# EAGLE design cc1101 (EAGLE 5.11)
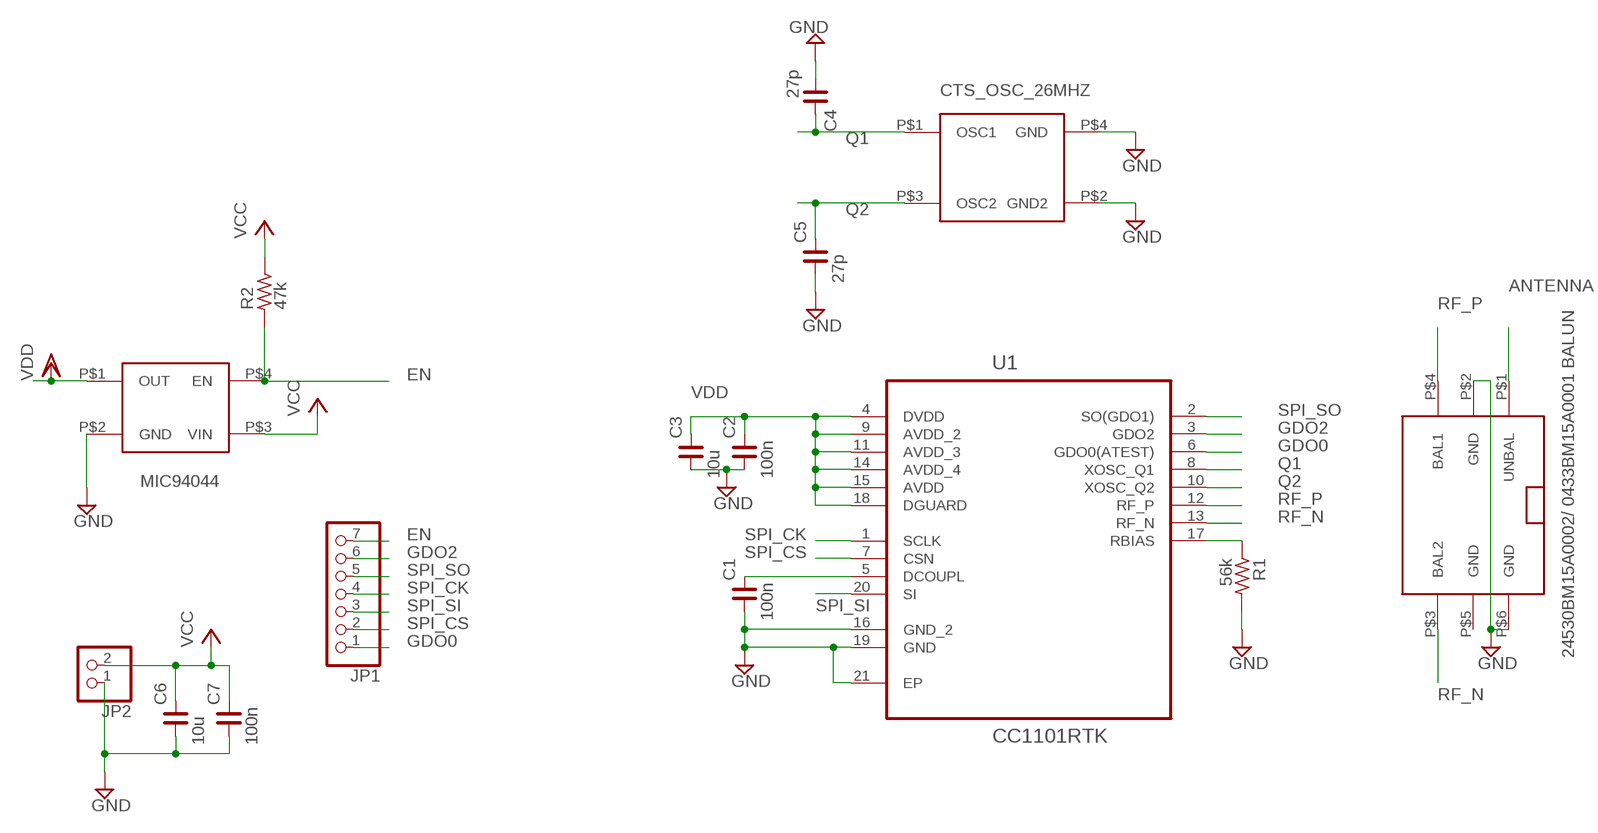
[diagram p0: schematic, sheet 1]

## Parts
C1  100n  C_0402  [C0402]
C2  100n  C_0402  [C0402]
C3  10u  C_0402  [C0402]
C4  27p  C_0402  [C0402]
C5  27p  C_0402  [C0402]
C6  10u  C_0402  [C0402]
C7  100n  C_0402  [C0402]
JP1  PINHD-1X7  [1X07]
JP2  PINHD-1X2  [1X02]
R1  56k  R_0402  [R0402]
R2  47k  R_0402  [R0402]
U1  CC1101RTK  [QFN50P400X400X90-21N]
U$1  26_MHZ_OSC  [CTS_26_PACKAGE]
U$2  MIC94044  [MIC94045YFL_FOOTPRINT]
U$3  24530BM15A0002  [24530BM15A0002]

## Nets
ANTENNA: U$3.P$1(UNBAL)
EN: JP1.7 R2.1 U$2.P$4(EN)
GDO0: JP1.1 U1.6(GDO0(ATEST))
GDO2: JP1.6 U1.3(GDO2)
GND: C1.1 C2.1 C3.1 C4.1 C5.1 C6.1 C7.1 JP2.1 R1.2 U1.16(GND_2) U1.19(GND) U1.21(EP) U$1.P$2(GND2) U$1.P$4(GND) U$2.P$2(GND) U$3.P$2(GND) U$3.P$6(GND)
N$5: R1.1 U1.17(RBIAS)
N$7: C1.2 U1.5(DCOUPL)
Q1: C4.2 U1.8(XOSC_Q1) U$1.P$1(OSC1)
Q2: C5.2 U1.10(XOSC_Q2) U$1.P$3(OSC2)
RF_N: U1.13(RF_N) U$3.P$3(BAL2)
RF_P: U1.12(RF_P) U$3.P$4(BAL1)
SPI_CK: JP1.4 U1.1(SCLK)
SPI_CS: JP1.2 U1.7(CSN)
SPI_SI: JP1.3 U1.20(SI)
SPI_SO: JP1.5 U1.2(SO(GDO1))
VCC: C6.2 C7.2 JP2.2 R2.2 U$2.P$3(VIN)
VDD: C2.2 C3.2 U1.4(DVDD) U1.9(AVDD_2) U1.11(AVDD_3) U1.14(AVDD_4) U1.15(AVDD) U1.18(DGUARD) U$2.P$1(OUT)

## Power pins joined to a net without a drawn wire
GND: U$3.P$5(GND)

## Library data of the parts
C1-C7 = rc-master-smd:C_: NON-POLARIZED CAP
JP1 = pinhead:PINHD-1X7: PIN HEADER
JP2 = pinhead:PINHD-1X2: PIN HEADER
R1 R2 = rc-master-smd:R_: RESISTOR
U1 = cc1101:CC1101RTK: Low-Power Sub-1 GHz RF Transceiver; MPN: CC1101RTK; OC_FARNELL: 1555264; OC_NEWARK: 50M8833; PACKAGE: QFN-20; SUPPLIER: Texas Instruments
U$1 = CTS_OSC:26_MHZ_OSC
U$2 = MIC94045YFL:MIC94044
U$3 = 24530BM15A0002:24530BM15A0002

## Board
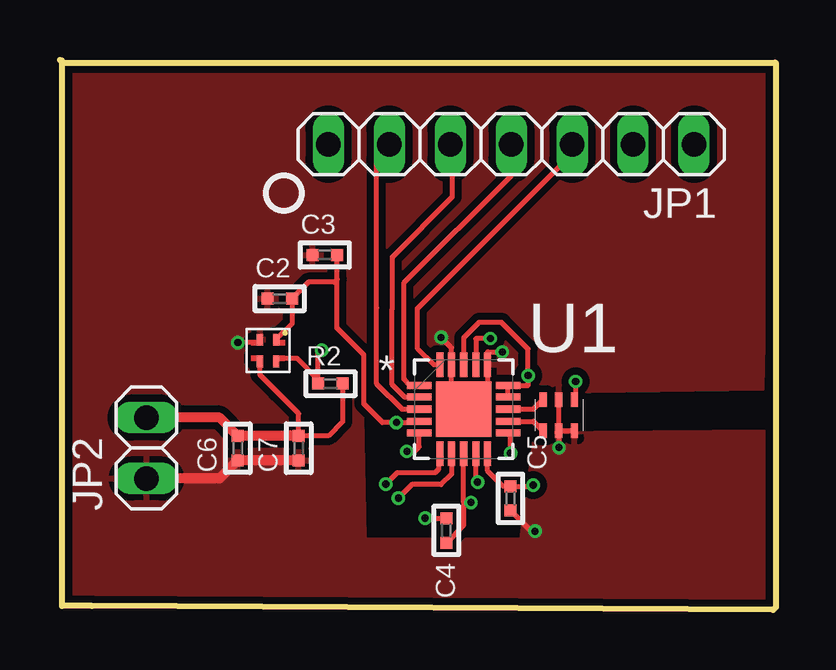
[diagram p1: board, top side]
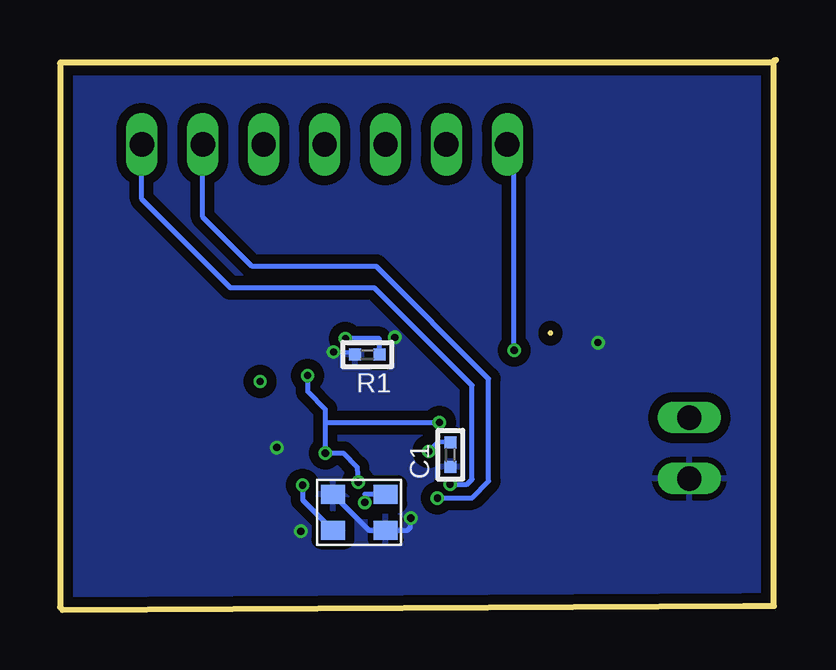
[diagram p2: board, bottom side, seen from below]

Size 29.85 x 22.93 mm. Coordinates in mm from the lower left corner, seen from the top.
Outline: 0,22.93 0.11,22.82 29.82,22.82 29.85,22.79 29.85,0.11 29.73,0 1.34,0.17 0.08,0.17 0.08,22.91
Copper layers (1*16): Top 0.035mm / dielectric 0.1mm / Bottom 0.035mm
Design rules "default *": minimum track width 0.1mm, minimum drill 0.1mm, track to track 0.16mm, track to pad 0.16mm, pad to pad 0.15mm, via to via 0.15mm, smd to smd 0.15mm, copper to edge 0.1mm, drill to drill 0.1mm, minimum pad ring 0.13mm, minimum via ring 0.13mm, stop-mask expansion 0.015mm, vias tented up to drill 8mil, thermal gap 10mil

### Footprints (pad centres in the part's own frame; a part is rotated, then mirrored left to right if it is on the bottom)
C0402 = smd 0.5 x 0.5: 1 -0.508,0; 2 0.508,0
1X07 = drill 1.016 long: 1 -7.62,0; 2 -5.08,0; 3 -2.54,0; 4 0,0; 5 2.54,0; 6 5.08,0; 7 7.62,0
1X02 = drill 1.016 long: 1 -1.27,0; 2 1.27,0
R0402 = smd 0.5 x 0.5: 1 -0.508,0; 2 0.508,0
QFN50P400X400X90-21N = smd 1.016 x 0.305: 1 -1.854,0.991; 2 -1.854,0.508; 3 -1.854,0; 4 -1.854,-0.508; 5 -1.854,-0.991; 11 1.854,-0.991; 12 1.854,-0.508; 13 1.854,0; 14 1.854,0.508; 15 1.854,0.991 | smd 0.305 x 1.016: 6 -0.991,-1.854; 7 -0.508,-1.854; 8 0,-1.854; 9 0.508,-1.854; 10 0.991,-1.854; 16 0.991,1.854; 17 0.508,1.854; 18 0,1.854; 19 -0.508,1.854; 20 -0.991,1.854 | smd 2.311 x 2.311: 21 0,0
CTS_26_PACKAGE = smd 1 x 0.8: P$1 -1.1,-0.75; P$2 1.1,-0.75; P$3 1.1,0.75; P$4 -1.1,0.75
MIC94045YFL_FOOTPRINT = smd 0.26 x 0.49: P$1 -0.341,-0.453; P$2 0.342,-0.454; P$3 0.342,0.457; P$4 -0.34,0.454
24530BM15A0002 = smd 0.6 x 0.3: P$1 -0.65,0.65; P$2 -0.65,0; P$3 -0.65,-0.65; P$4 0.65,-0.65; P$5 0.65,0; P$6 0.65,0.65

### Placement (x,y rotation side)
C1  13.57,6.47 90 bottom
C2  9.16,12.98 0 top
C3  11.04,14.8 0 top
C4  16.11,3.32 270 top
C5  18.78,4.65 90 top
C6  7.41,6.75 90 top
C7  9.95,6.75 90 top
JP1  18.82,19.42 180 top
JP2  3.6,6.75 90 top
R1  17.04,10.65 180 bottom
R2  11.28,9.44 0 top
U1  16.83,8.37 0 top
U$1  17.37,4.08 180 bottom
U$2  8.68,10.82 180 top
U$3  20.8,8.12 270 top

### Tracks (layer width: path | path; a pad name or v marks a point on that pad's centre or on a via)
ANTENNA  (via drill 0.3)
  Top 0.2: U$3.P$1 21.51,8.83 v21.5,9.53
EN  (via drill 0.3)
  Top 0.2: U$2.P$4 9.14,10.48 9.91,10.48 10.77,9.62 R2.1 | R2.1 10.78,9.42 10.83,9.42 10.78,9.37 10.77,9.35 10.73,9.35 10.7,9.38 10.7,9.45 | v10.91,10.83 10.77,10.69 R2.1
  Bottom 0.2: JP1.7 10.91,19.14 v10.91,10.83
GDO0  (via drill 0.3)
  Top 0.2: U1.6 15.79,6.46 15.79,5.87 15.64,5.72 14.06,5.72 v13.58,5.24
  Bottom 0.2: v13.58,5.24 12.87,5.24 12.67,5.45 12.67,9.36 16.74,13.43 22.74,13.43 26.44,17.13 JP1.1
GDO2
  Top 0.2: U1.3 14.25,8.37 13.2,9.42 13.2,12.6 | 13.2,12.6 13.21,12.6 | 13.2,12.6 13.2,18.89 JP1.6
GND  (via drill 0.3)
  Top 0.2: U$3.P$5 U$3.P$2 | v15.89,11.37 16.32,10.93 U1.19 16.32,8.88 U1.21 | C4.1 v15.22,3.83 | 17.85,9.2 17.85,10.2 U1.16 17.82,10.76 v18.44,10.76 | U$3.P$5 20.8,6.74 v20.8,6.78 | U$3.P$6 U$3.P$5 | U$2.P$2 8.21,11.15 v7.41,11.15 | C5.1 19.65,3.28 v19.8,3.28
  Top 0.406: C7.1 C6.1 6.65,5.48 JP2.1
  Bottom 0.2: v18.44,10.76 17.64,10.74 R1.2 | v15.22,3.83 15.24,3.81 15.24,3.44 15.35,3.33 U$1.P$4 16.97,3.33 U$1.P$2
  pour Bottom (isolate 0.4): 29.81,22.69 29.81,0.13 0.12,0.03 0.12,22.61
  pour Top (isolate 0.3, rank 4): 0.53,22.64 29.61,22.67 29.33,9.19 0.54,8.77 0.29,22.58
  pour Top (isolate 0.3, rank 2): 2.27,9.13 12.61,9.1 12.74,2.97 19.2,2.97 19.78,7.41 29.65,7.49 29.61,0.3 0.29,0.3 0.54,9.16 0.99,9.12
N$5  (via drill 0.3)
  Top 0.2: U1.17 17.34,11.31 v17.94,11.32
  Bottom 0.2: R1.1 16.53,11.31 v17.94,11.31 v17.94,11.32
N$7  (via drill 0.3)
  Top 0.2: U1.5 14.98,6.81 14.78,6.61 v14.47,6.61
  Bottom 0.2: v14.47,6.61 14.08,7 C1.2
Q1  (via drill 0.3)
  Top 0.2: 16.83,4.48 U1.8 | C4.2 16.83,3.53 16.83,4.48 | v17.13,4.48 16.83,4.48
  Bottom 0.2: v17.13,4.48 17.13,4.83 U$1.P$1
Q2  (via drill 0.3)
  Top 0.2: U1.10 17.82,5.81 18.47,5.16 C5.2 19.69,5.16 v19.73,5.21
  Bottom 0.2: U$1.P$3 19.73,4.59 v19.73,5.21
RF_N
  Top 0.2: U1.13 19.75,8.37 U$3.P$3
RF_P
  Top 0.2: U1.12 19.75,7.86 U$3.P$4
SPI_CK
  Top 0.2: U1.1 14.6,9.36 14.34,9.63 14.35,9.64 14.35,13.65 18.81,18.11 JP1.4
SPI_CS  (via drill 0.3)
  Top 0.2: U1.7 16.32,5.66 15.89,5.23 14.68,5.23 v14.11,4.67
  Bottom 0.2: v14.11,4.67 v14.11,4.68 12.66,4.68 11.97,5.36 11.97,9.64 16.65,14.32 21.83,14.32 23.9,16.38 JP1.2
SPI_SI
  Top 0.2: U1.20 15.59,10.23 14.9,10.91 14.9,12.57 21.35,19.02 JP1.3
SPI_SO
  Top 0.2: U1.2 14.37,8.88 13.85,9.4 13.85,12.55 13.86,12.56 13.86,14.72 16.36,17.23 16.36,19.34 JP1.5
VCC
  Top 0.2: U$2.P$3 8.33,9.81 9.95,8.19 C7.2 11.19,7.26 11.79,7.85 R2.2
  Top 0.254: C7.2 9.88,7.33 9.57,7.33 9.61,7.37
  Top 0.406: C7.2 C6.2 6.65,8.02 JP2.2
VDD  (via drill 0.3)
  Top 0.2: 17.33,6.5 U1.9 17.34,5.55 v17.41,5.33 | U1.4 14.93,7.82 v14.03,7.82 13.45,7.82 12.67,8.6 12.67,10.63 11.55,11.75 11.55,13.78 | U1.11 18.79,7.28 18.78,7.28 v18.78,6.54 | U1.14 U1.15 19.52,9.36 v19.52,9.78 19.51,9.79 19.51,10.89 18.41,11.99 17.47,11.99 16.83,11.35 U1.18 | U$2.P$1 9.67,11.92 C2.2 10.36,13.67 11.44,13.67 11.55,13.78 | C3.2 11.55,13.78
  Bottom 0.2: v18.78,6.54 18.78,6.53 | v17.41,5.33 17.45,5.95 18.04,6.54 v18.78,6.54 | 18.78,7.86 18.78,8.37 19.52,9.11 v19.52,9.78 | 18.78,7.86 v18.78,6.54 | v14.03,7.82 18.74,7.82 18.78,7.86